# Altium schematic sheet SH7 - GPIO Expander.SchDoc
size A4
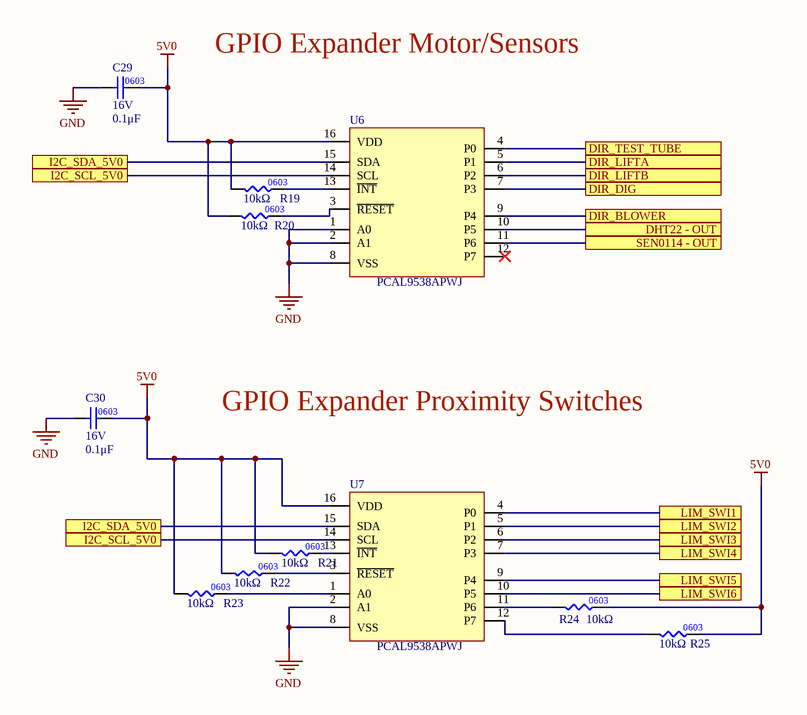
[diagram p0: SH7 - GPIO Expander.SchDoc]

## Parts
C29  value 0.1μF  Voltage Rating: 16V  [CAP0603]  (hidden comment: CAP_0.1uF_16V_0603)
C30  value 0.1μF  Voltage Rating: 16V  [CAP0603]  (hidden comment: CAP_0.1uF_16V_0603)
R19  value 10kΩ  [RES0603]  (hidden comment: RES_10kΩ_0603_5%)
R20  value 10kΩ  [RES0603]  (hidden comment: RES_10kΩ_0603_5%)
R21  value 10kΩ  [RES0603]  (hidden comment: RES_10kΩ_0603_5%)
R22  value 10kΩ  [RES0603]  (hidden comment: RES_10kΩ_0603_5%)
R23  value 10kΩ  [RES0603]  (hidden comment: RES_10kΩ_0603_5%)
R24  value 10kΩ  [RES0603]  (hidden comment: RES_10kΩ_0603_5%)
R25  value 10kΩ  [RES0603]  (hidden comment: RES_10kΩ_0603_5%)
U6  8 Channel I2C GPIO Expander  [TSSOP16]  (value not drawn)
U7  8 Channel I2C GPIO Expander  [TSSOP16]  (value not drawn)

## Ports
DHT22 - OUT, DIR_BLOWER, DIR_DIG, DIR_LIFTA, DIR_LIFTB, DIR_TEST_TUBE, I2C_SCL_5V0, I2C_SDA_5V0, LIM_SWI1, LIM_SWI2, LIM_SWI3, LIM_SWI4, LIM_SWI5, LIM_SWI6, SEN0114 - OUT

## Nets
5V0: C29.2 C30.2 R19.1 R20.1 R21.1 R22.1 R23.1 R24.2 R25.2 U6.16(VDD) U7.16(VDD)
GND: C29.1 C30.1 U6.1(A0) U6.2(A1) U6.8(VSS) U7.2(A1) U7.8(VSS)
DHT22 - OUT: U6.10(P5) ; port DHT22 - OUT
DIR_BLOWER: U6.9(P4) ; port DIR_BLOWER
DIR_DIG: U6.7(P3) ; port DIR_DIG
DIR_LIFTA: U6.5(P1) ; port DIR_LIFTA
DIR_LIFTB: U6.6(P2) ; port DIR_LIFTB
DIR_TEST_TUBE: U6.4(P0) ; port DIR_TEST_TUBE
I2C_SCL_5V0: U6.14(SCL) U7.14(SCL) ; port I2C_SCL_5V0
I2C_SDA_5V0: U6.15(SDA) U7.15(SDA) ; port I2C_SDA_5V0
LIM_SWI1: U7.4(P0) ; port LIM_SWI1
LIM_SWI2: U7.5(P1) ; port LIM_SWI2
LIM_SWI3: U7.6(P2) ; port LIM_SWI3
LIM_SWI4: U7.7(P3) ; port LIM_SWI4
LIM_SWI5: U7.9(P4) ; port LIM_SWI5
LIM_SWI6: U7.10(P5) ; port LIM_SWI6
SEN0114 - OUT: U6.11(P6) ; port SEN0114 - OUT
NetR19_2: R19.2 U6.13(~{INT})
NetR20_2: R20.2 U6.3(~{RESET})
NetR21_2: R21.2 U7.13(~{INT})
NetR22_2: R22.2 U7.3(~{RESET})
NetR23_2: R23.2 U7.1(A0)
NetR24_1: R24.1 U7.11(P6)
NetR25_1: R25.1 U7.12(P7)

Not connected (* = marked no-connect by the designer): U6 12(P7)*

## Notes on the sheet
- GPIO Expander Motor/Sensors
- GPIO Expander Proximity Switches
- (in symbol IC_GPIO_I2C_EXPANDER 8CH 16TSSOP) PCAL9538APWJ

## Library data of the parts
C29 C30 = CAP_0.1uF_16V_0603: CAP CER 0.1UF 16V X7R 0603; Manufacturer Part Number 1: CC0603KRX7R7BB104; Manufacturer 1: Yageo; Package: 0603; Supplier Part Number 1: 311-1088-1-ND; Supplier 1: Digi-Key; Dielectric: X7R
R19-R25 = RES_10kΩ_0603_5%: RES 10K OHM 5% 1/10W 0603; Manufacturer 1: Yageo; Manufacturer Part Number 1: RC0603JR-0710KL; Supplier Part Number 1: 311-10KGRCT-ND; Supplier 1: Digi-Key; Mounting Type: SMD; Package: 0603
U6 U7 = IC_GPIO_I2C_EXPANDER 8CH 16TSSOP: Manufacturer: NXP USA Inc.; Voltage - Supply: 1.65V ~ 5.5V; Clock Frequency: 400 kHz; Current - Output Source/Sink: 10mA, 25mA; Supplier 1: Digi-Key; Package / Case: 16-TSSOP; Operating Temperature: -40°C ~ 85°C; Supplier Part Number 1: 568-9924-1-ND